# EAGLE schematic TYPEII (EAGLE 9.6.1)
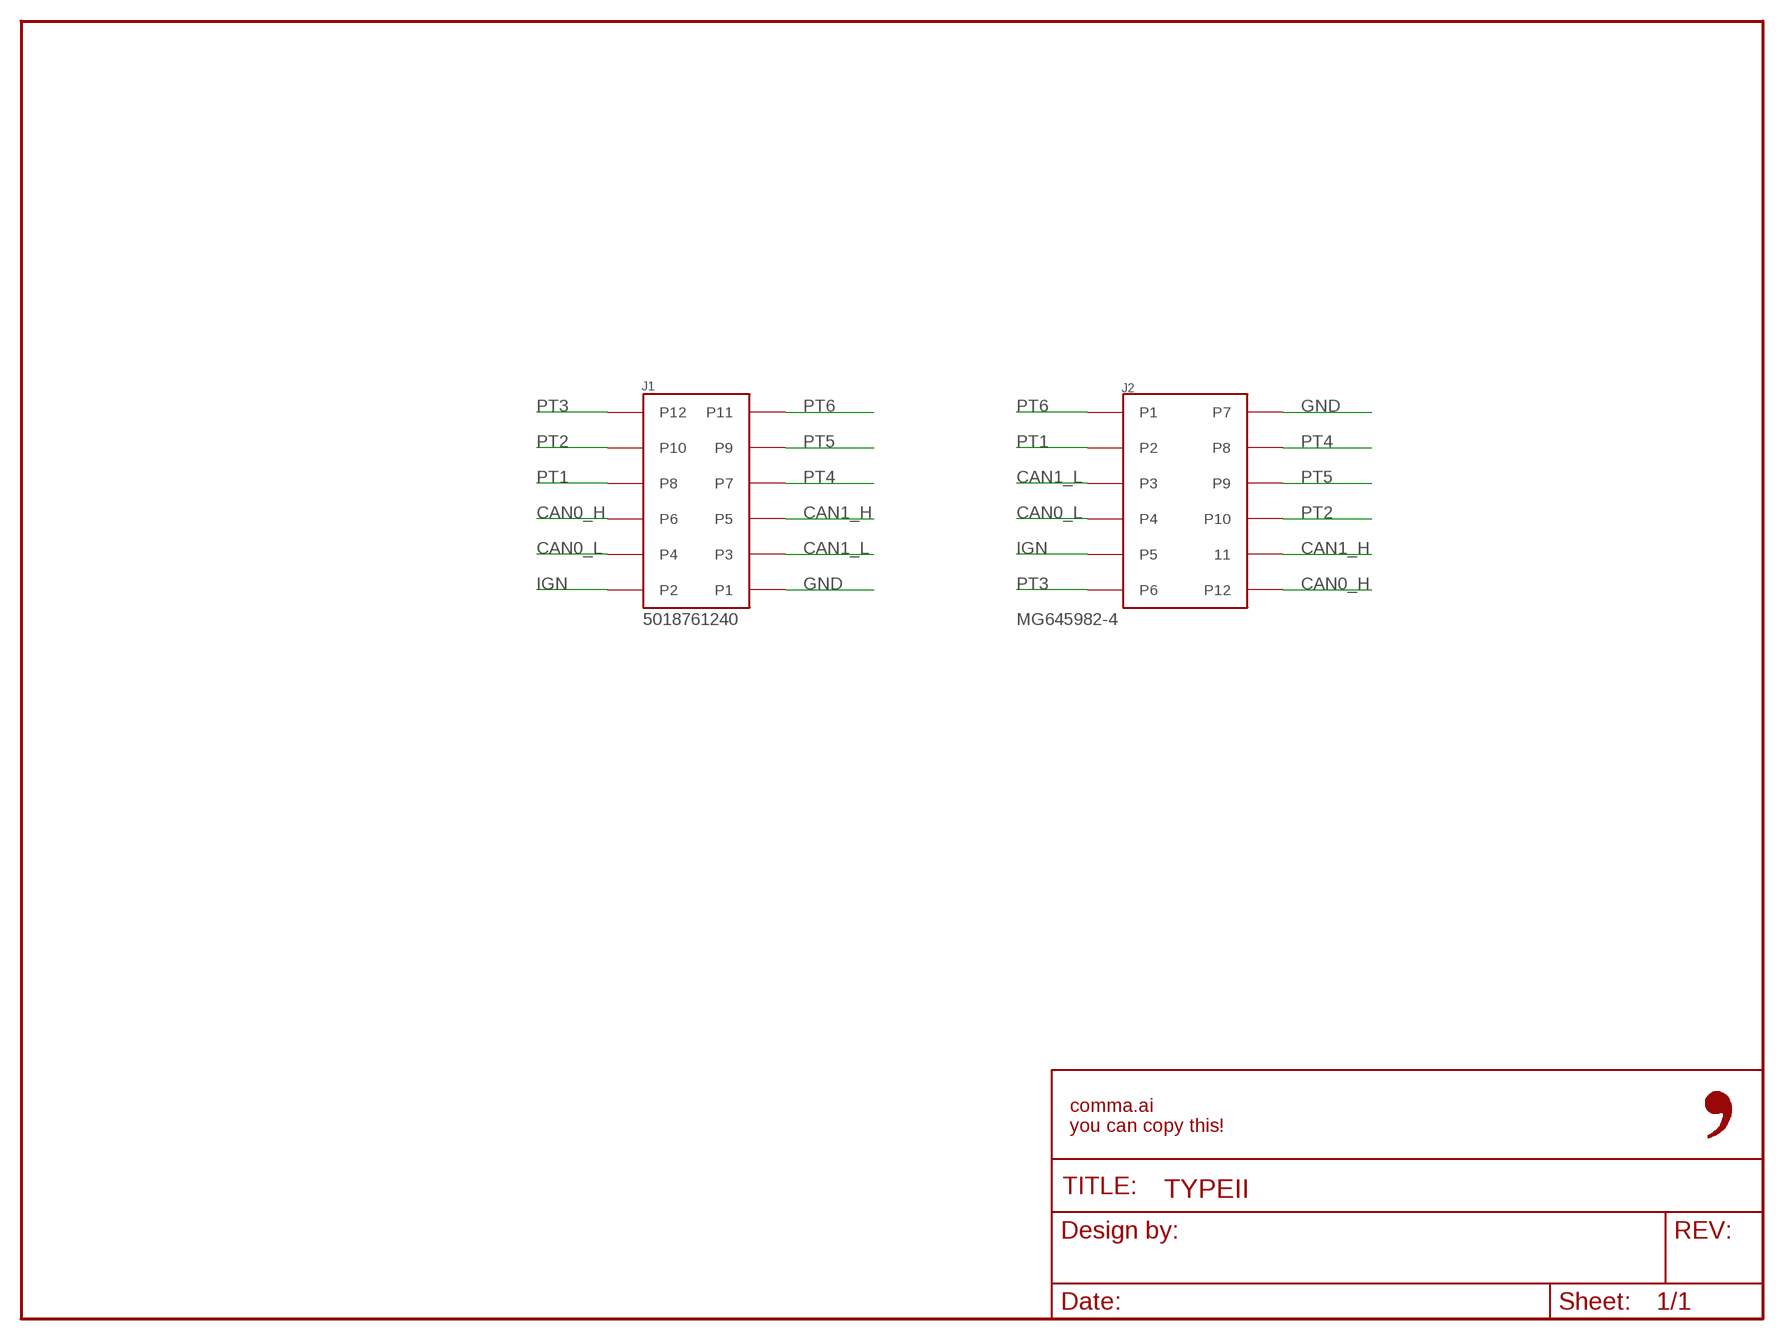
[diagram p0: schematic, sheet 1]

## Parts
FRAME1  FRAME-LETTER-OPENNO_PACKAGE  [DUMMY]
J1  5018761240  [5018761240]
J2  MG645845  [MG645845]

## Nets
CAN0_H: J1.P6 J2.P12
CAN0_L: J1.P4 J2.P4
CAN1_H: J1.P5 J2.P11
CAN1_L: J1.P3 J2.P3
GND: J1.P1 J2.P7
IGN: J1.P2 J2.P5
PT1: J1.P8 J2.P2
PT2: J1.P10 J2.P10
PT3: J1.P12 J2.P6
PT4: J1.P7 J2.P8
PT5: J1.P9 J2.P9
PT6: J1.P11 J2.P1

## Notes on the sheet
- 5018761240 | MG645982-4

## Library data of the parts
FRAME1 = comma.ai:FRAME-LETTER-OPEN: Schematic Frame - Letter Standard 8.5x11 US Letter frame; DESIGNER: Nobody; VERSION: v01
J1 = 5018761440:5018761240; CPN: CAI-HARNESS-MOLEX-5018761240; MPN: 5018761240
J2 = MG645845:MG645845; CPN: CAI-HARNESS-KET-MG645845; MPN: MG645845